# EAGLE design blocslave (EAGLE 8.2.2)
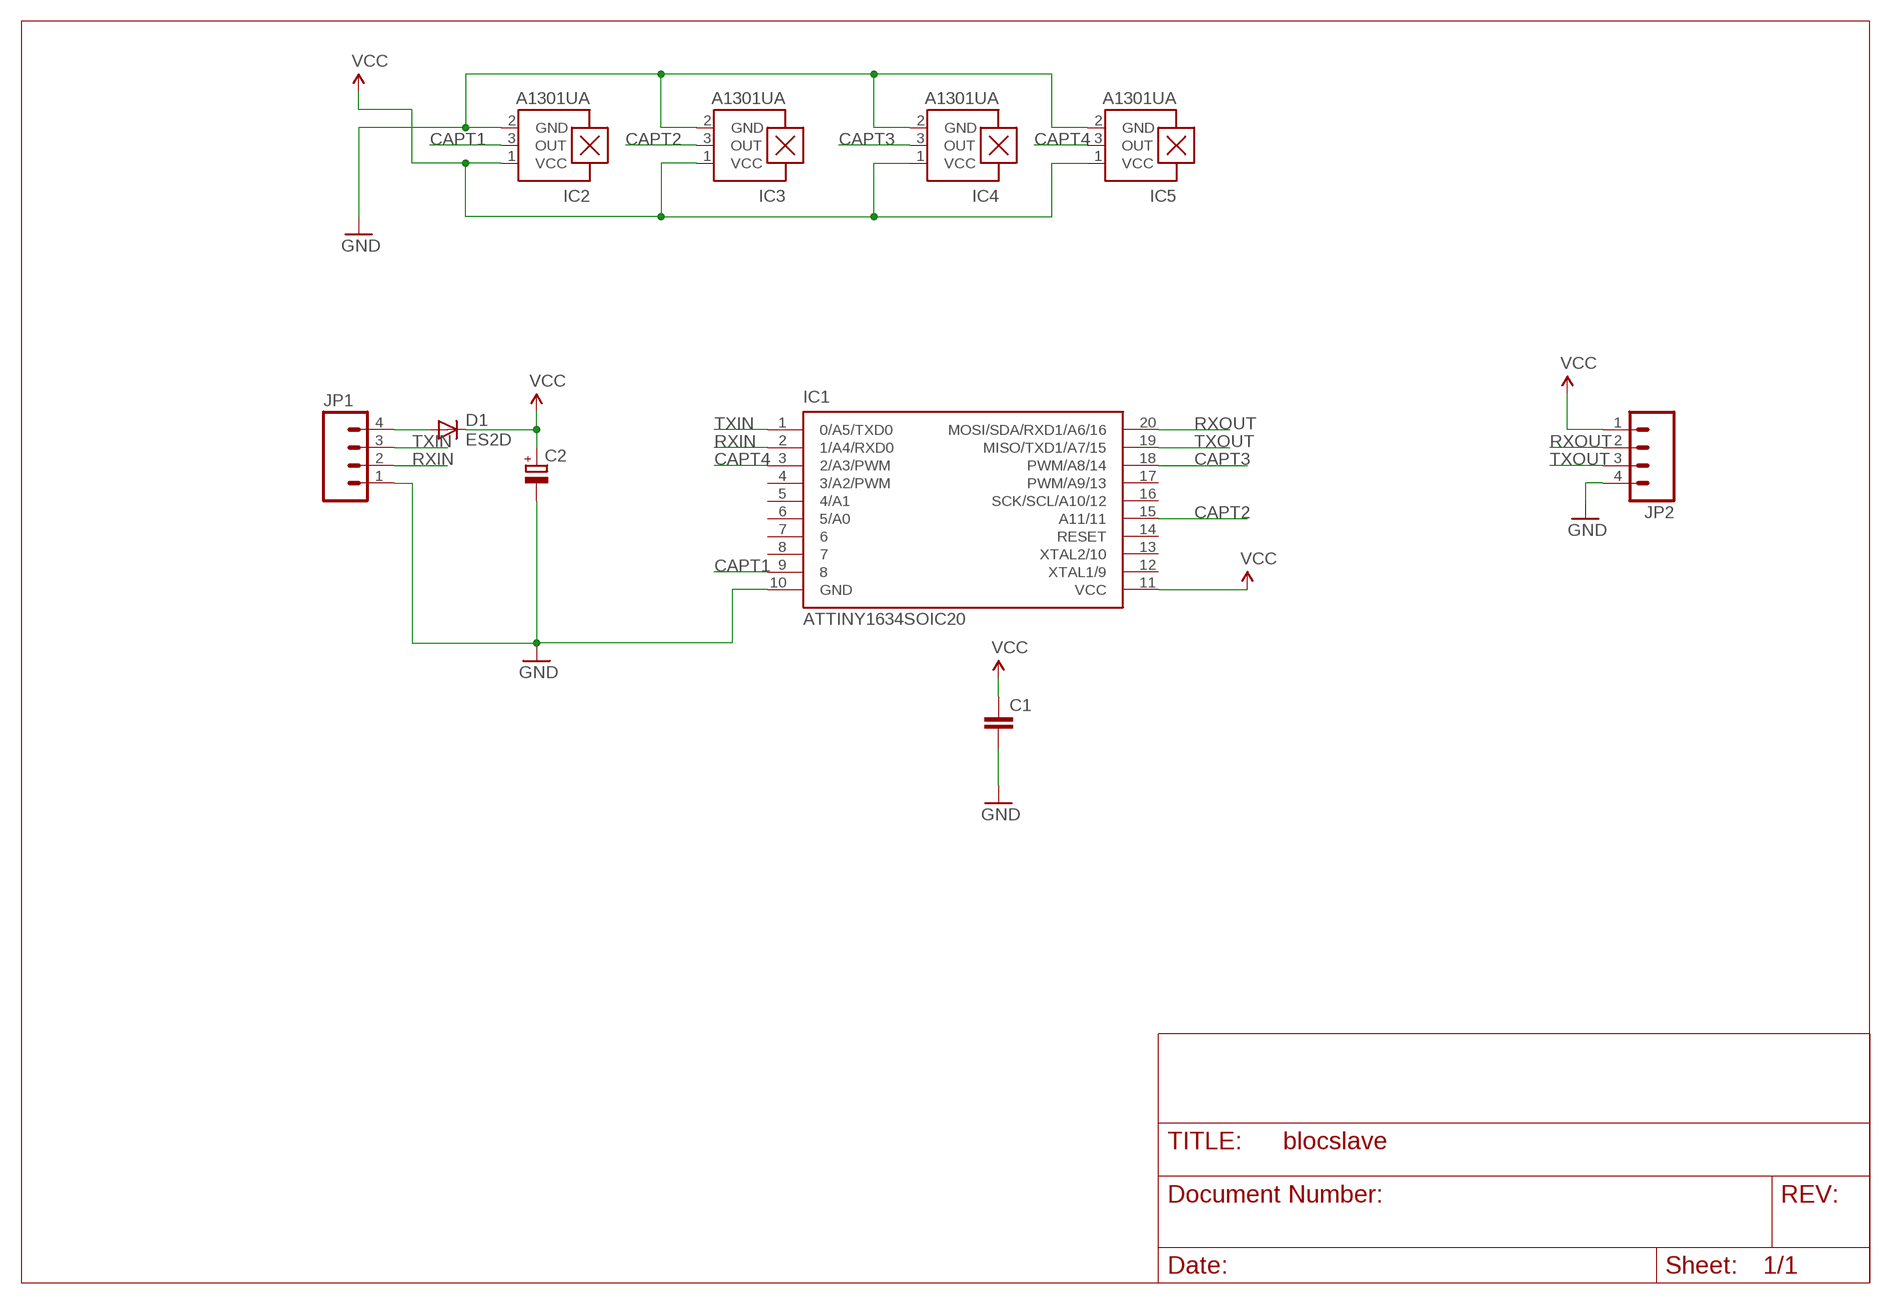
[diagram p0: schematic, sheet 1]

## Parts
C1  C-EUC1206  [C1206]
C2  CPOL-EUSMCD  [SMC_D]
D1  ES2D  [SMB]
IC1  ATTINY1634SOIC20  [SOIC20]
IC2  A1301UA  [SIP3-UA]
IC3  A1301UA  [SIP3-UA]
IC4  A1301UA  [SIP3-UA]
IC5  A1301UA  [SIP3-UA]
JP1  M04  [1X04]
JP2  M04  [1X04]

## Nets
CAPT1: IC1.9 IC2.3(OUT)
CAPT2: IC1.15(A11/11) IC3.3(OUT)
CAPT3: IC1.18(PWM/A8/14) IC4.3(OUT)
CAPT4: IC1.3(2/A3/PWM) IC5.3(OUT)
GND: C1.2 C2.- IC1.10(GND) IC2.2(GND) IC3.2(GND) IC4.2(GND) IC5.2(GND) JP1.1 JP2.4
N$10: D1.A JP1.4
RXIN: IC1.2(1/A4/RXD0) JP1.2
RXOUT: IC1.20(MOSI/SDA/RXD1/A6/16) JP2.2
TXIN: IC1.1(0/A5/TXD0) JP1.3
TXOUT: IC1.19(MISO/TXD1/A7/15) JP2.3
VCC: C1.1 C2.+ D1.C IC1.11(VCC) IC2.1(VCC) IC3.1(VCC) IC4.1(VCC) IC5.1(VCC) JP2.1
Unconnected: IC1.4(3/A2/PWM) IC1.5(4/A1) IC1.6(5/A0) IC1.7 IC1.8 IC1.12(XTAL1/9) IC1.13(XTAL2/10) IC1.14(RESET) IC1.16(SCK/SCL/A10/12) IC1.17(PWM/A9/13)

## Library data of the parts
C1 = LivetProjet:C-EU: CAPACITOR, European symbol
C2 = LivetProjet:CPOL-EU: POLARIZED CAPACITOR, European symbol
D1 = LivetProjet:ES2D: DIODE super fast rectifier, 2 A
IC1 = LivetProjet:ATTINY1634
IC2-IC5 = allegro:A13*?: Linear Hall Effect Sensor ICs Continuous-Time Ratiometric High-Temperature Operation Programmable Linear with Analog Output A1302 -Replacement- UGN3503 Source: http://www.allegromicro.com/en/Products/Part_Numbers/1301/1301.pdf http://www.allegromicro.com/en/Products/Part_Numbers/1321/1321.pdf http://www.allegromicro.com/en/Products/Part_Numbers/1381/1381.pdf; MF: ALLEGRO MICROSYSTEMS, INC.; MPN: A1301EUA-T; OC_FARNELL: 1198085; OC_NEWARK: 31K6635
JP1 JP2 = LivetProjet:M04: Header 4 Standard 4-pin 0.1" header. Use with straight break away headers (SKU : PRT-00116), right angle break away headers (PRT-00553), swiss pins (PRT-00743), machine pins (PRT-00117), and female headers (PRT-00115). Molex polarized connector foot print use with SKU : PRT-08231 with associated crimp pins and housings. 1MM SMD Version SKU: PRT-10208

## Board
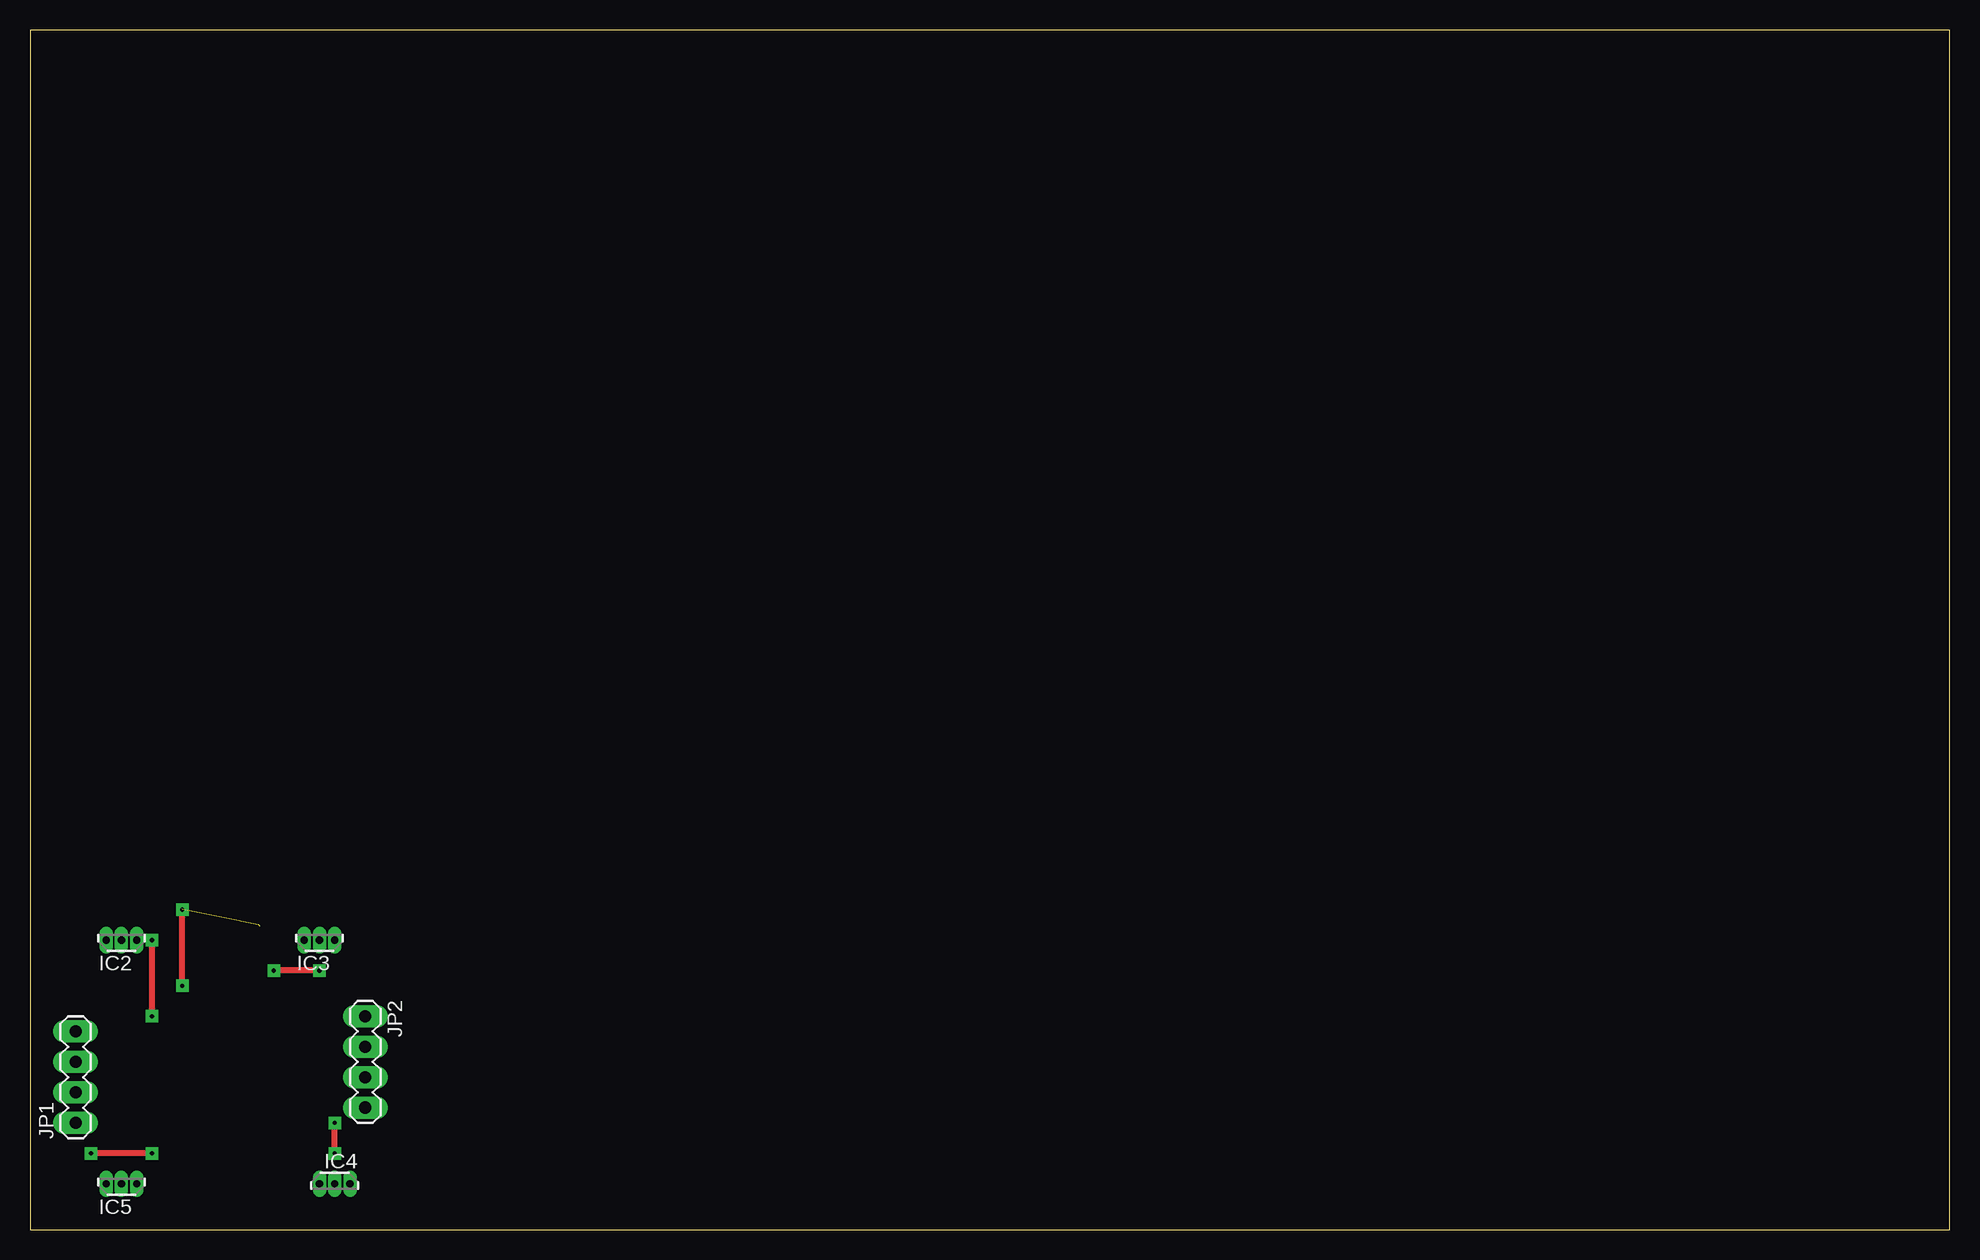
[diagram p1: board, top side]
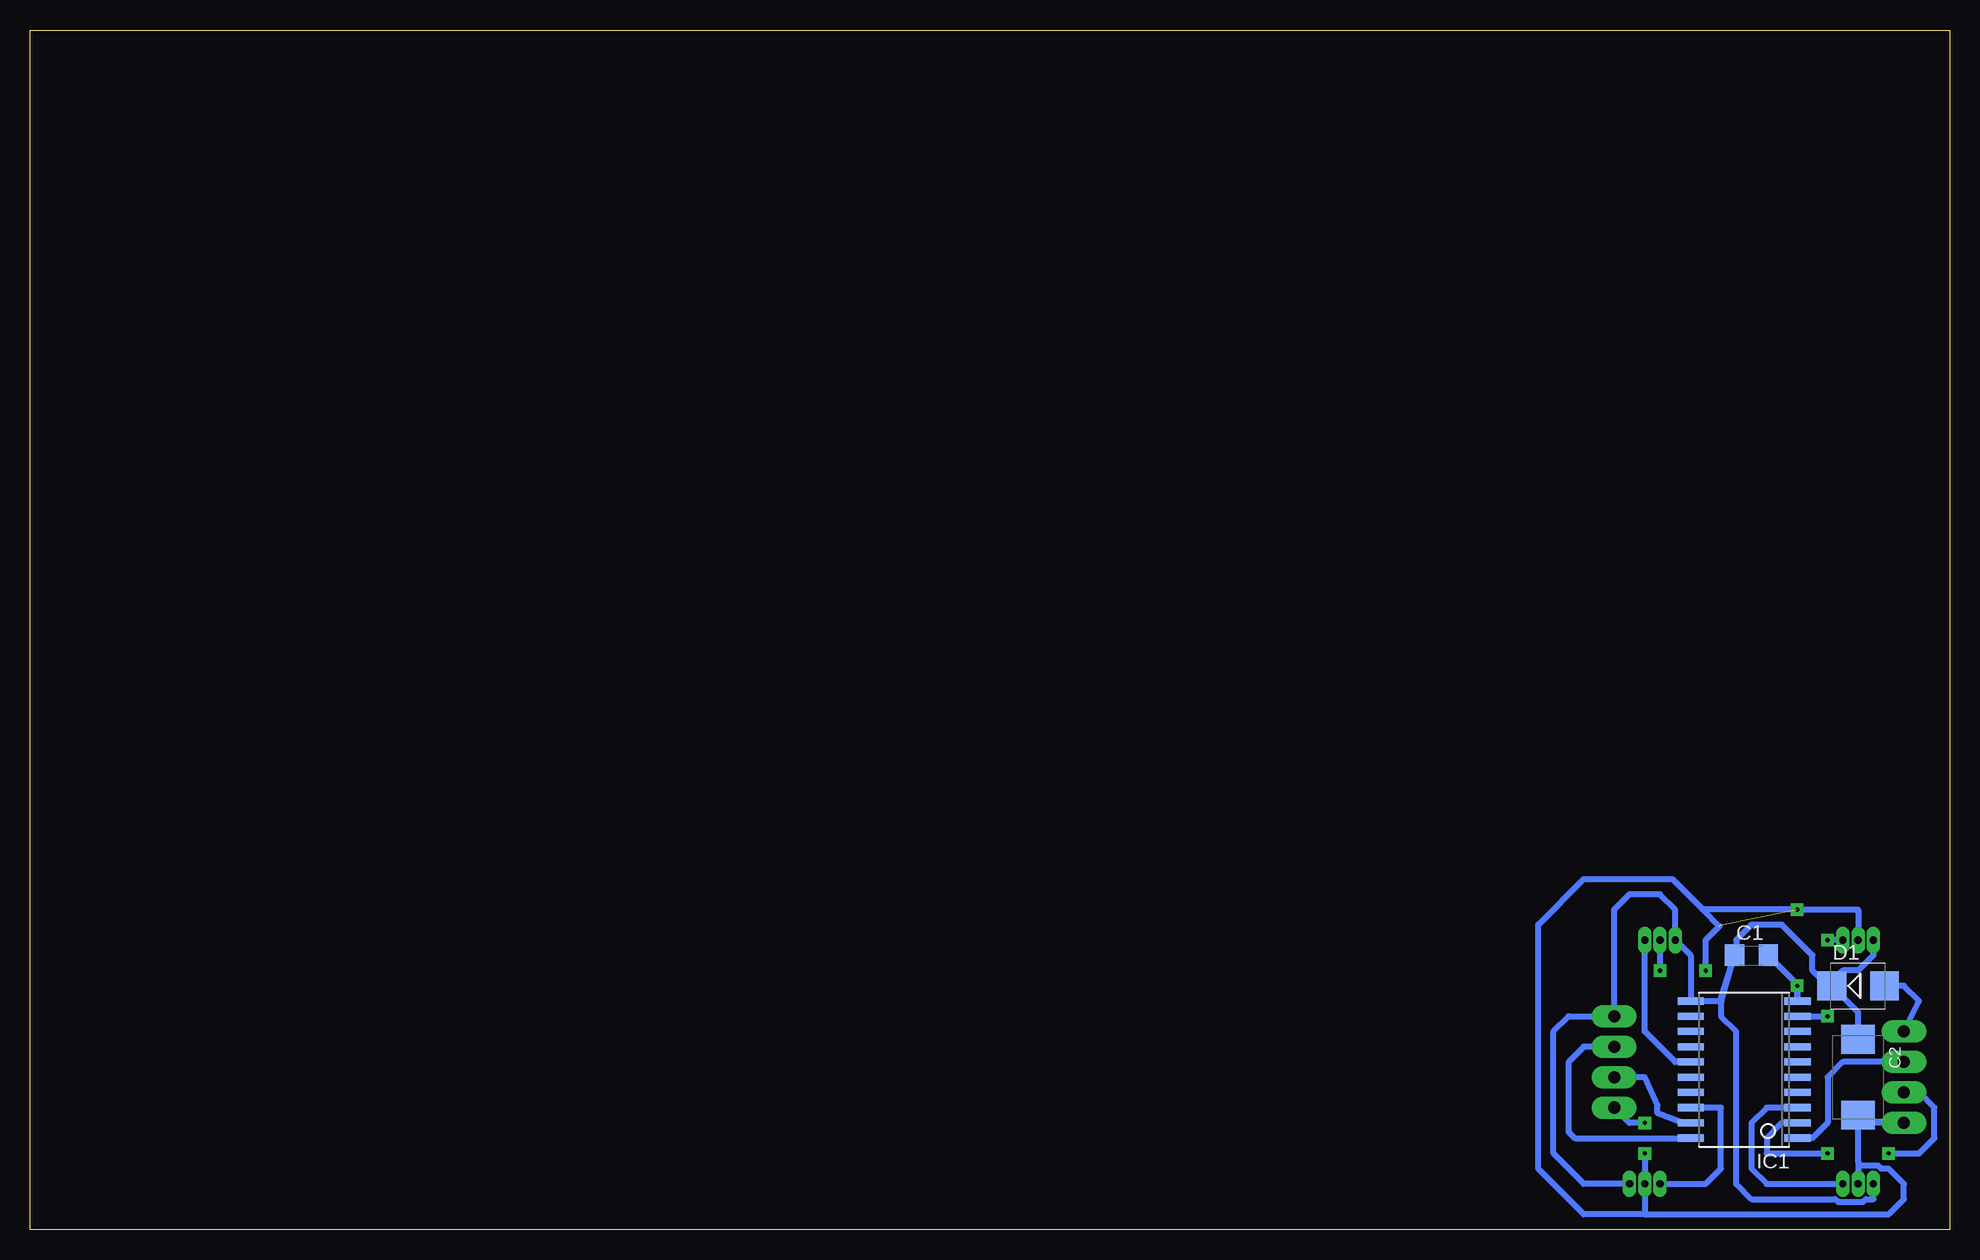
[diagram p2: board, bottom side, seen from below]

Size 160 x 100 mm. Coordinates in mm from the lower left corner, seen from the top.
Outline: 0,0 160,0 160,100 0,100 0,0
Copper layers (1*16): Top 0.035mm / dielectric 1.5mm / Bottom 0.035mm
Design rules "default": minimum track width 6mil, minimum drill 0.35mm, track to track 6mil, track to pad 6mil, pad to pad 6mil, via to via 6mil, smd to smd 6mil, copper to edge 40mil, drill to drill 6mil, minimum pad ring 10mil, minimum via ring 8mil, stop-mask expansion 4mil, vias tented up to drill 0mil, thermal gap 10mil

### Footprints (pad centres in the part's own frame; a part is rotated, then mirrored left to right if it is on the bottom)
C1206 = smd 1.6 x 1.8: 1 -1.4,0; 2 1.4,0
SMC_D = smd 2.4 x 2.8: + -3.15,0; - 3.15,0
SMB = smd 2.4 x 2.4: A 2.2,0; C -2.2,0
SOIC20 = smd 0.6 x 2.2: 1 0,-0.025; 2 1.27,-0.025; 3 2.54,-0.025; 4 3.81,-0.025; 5 5.08,-0.025; 6 6.35,-0.025; 7 7.62,-0.025; 8 8.89,-0.025; 9 10.16,-0.025; 10 11.43,-0.025; 11 11.43,8.865; 12 10.16,8.865; 13 8.89,8.865; 14 7.62,8.865; 15 6.35,8.865; 16 5.08,8.865; 17 3.81,8.865; 18 2.54,8.865; 19 1.27,8.865; 20 0,8.865
SIP3-UA = drill 0.6 pad 0.7 long: 1 -1.27,0; 2 0,0; 3 1.27,0
1X04 = drill 1.016 pad 1.88 long: 1 -3.81,0; 2 -1.27,0; 3 1.27,0; 4 3.81,0

### Placement (x,y rotation side)
C1  16.51,22.86 0 bottom
C2  7.62,12.7 270 bottom
D1  7.62,20.32 0 bottom
IC1  12.7,7.62 90 bottom
IC2  7.62,24.13 0 top
IC3  24.13,24.13 0 top
IC4  25.4,3.81 180 top
IC5  7.62,3.81 0 top
JP1  3.81,12.7 90 top
JP2  27.94,13.97 270 top

### Tracks (layer width: path | path; a pad name or v marks a point on that pad's centre or on a via)
CAPT1  (via drill 0.35 pad 1.05)
  Top 0.508: v10.16,24.13 v10.16,17.78
  Bottom 0.508: IC2.3 v10.16,24.13 | IC1.9 v10.16,17.78
CAPT2
  Bottom 0.508: IC1.15 22.86,13.97 25.4,16.51 IC3.3
CAPT3
  Bottom 0.508: IC4.3 20.32,3.81 19.05,5.08 19.05,10.16 IC1.18
CAPT4
  Bottom 0.508: IC1.3 15.24,10.16 16.51,8.89 16.51,5.08 15.24,3.81 IC5.3
GND  (via drill 0.35 pad 1.05)  (2 unrouted)
  Top 0.508: v25.4,6.35 v25.4,8.89 | v12.7,20.32 v12.7,26.67 | v24.13,21.59 v20.32,21.59
  Bottom 0.508: 7.62,5.61 C2.- 6.96,8.89 JP1.1 | 7.62,5.61 IC5.2 | v25.4,6.35 IC4.2 25.4,1.27 | v25.4,8.89 26.67,8.89 JP2.4 | 25.4,1.27 5.08,1.27 3.81,2.54 3.81,3.81 5.08,5.08 5.71,5.08 5.95,5.32 7.33,5.32 7.62,5.61 | v12.7,20.32 12.68,20.3 IC1.10 12.68,20.43 C1.2 | IC2.2 7.62,26.67 11.43,26.67 v12.7,26.67 20.57,26.67 | IC3.2 v24.13,21.59 | v20.32,21.59 20.32,24.13 19.17,25.28 20.57,26.67 | 25.4,1.27 30.48,1.27 34.29,5.08 34.29,25.4 30.48,29.21 23.11,29.21 20.57,26.67
N$10
  Bottom 0.508: JP1.4 2.54,19.05 3.81,20.32 D1.A
RXIN  (via drill 0.35 pad 1.05)
  Top 0.508: v10.16,6.35 v5.08,6.35
  Bottom 0.508: IC1.2 13.97,8.89 15.24,7.62 15.24,6.35 v10.16,6.35 | v5.08,6.35 2.54,6.35 1.27,7.62 1.27,10.16 2.54,11.43 JP1.2
RXOUT
  Bottom 0.508: JP2.2 30.48,15.24 31.75,13.97 31.75,8.12 31.25,7.62 IC1.20
TXIN
  Bottom 0.508: JP1.3 8.89,13.97 10.16,12.7 10.16,8.89 11.43,7.62 IC1.1
TXOUT
  Bottom 0.508: IC1.19 22.27,8.89 24.34,9.69 24.34,10.37 25.4,12.7 JP2.3
VCC
  Bottom 0.508: C2.+ 7.62,18.12 D1.C 10.16,20.32 | IC4.1 30.48,3.81 33.02,6.35 33.02,16.51 31.75,17.78 JP2.1 27.94,26.67 26.67,27.94 24.13,27.94 22.86,26.67 IC3.1 21.57,22.84 IC1.11 19.02,19.05 19.01,19.05 | IC5.1 6.35,2.54 6.98,2.54 7.22,2.3 9.29,2.3 9.53,2.54 16.51,2.54 17.78,3.81 17.78,16.51 19.05,17.78 19.05,18.92 19.01,19.05 | 18.05,22.39 C1.1 19.05,19.18 | 19.01,19.05 18.05,22.39 | 10.16,20.32 11.43,21.59 11.43,22.86 13.97,25.4 16.51,25.4 17.78,24.13 17.78,22.65 18.05,22.39 | IC2.1 6.35,22.86 7.62,21.59 8.89,21.59 10.16,20.32